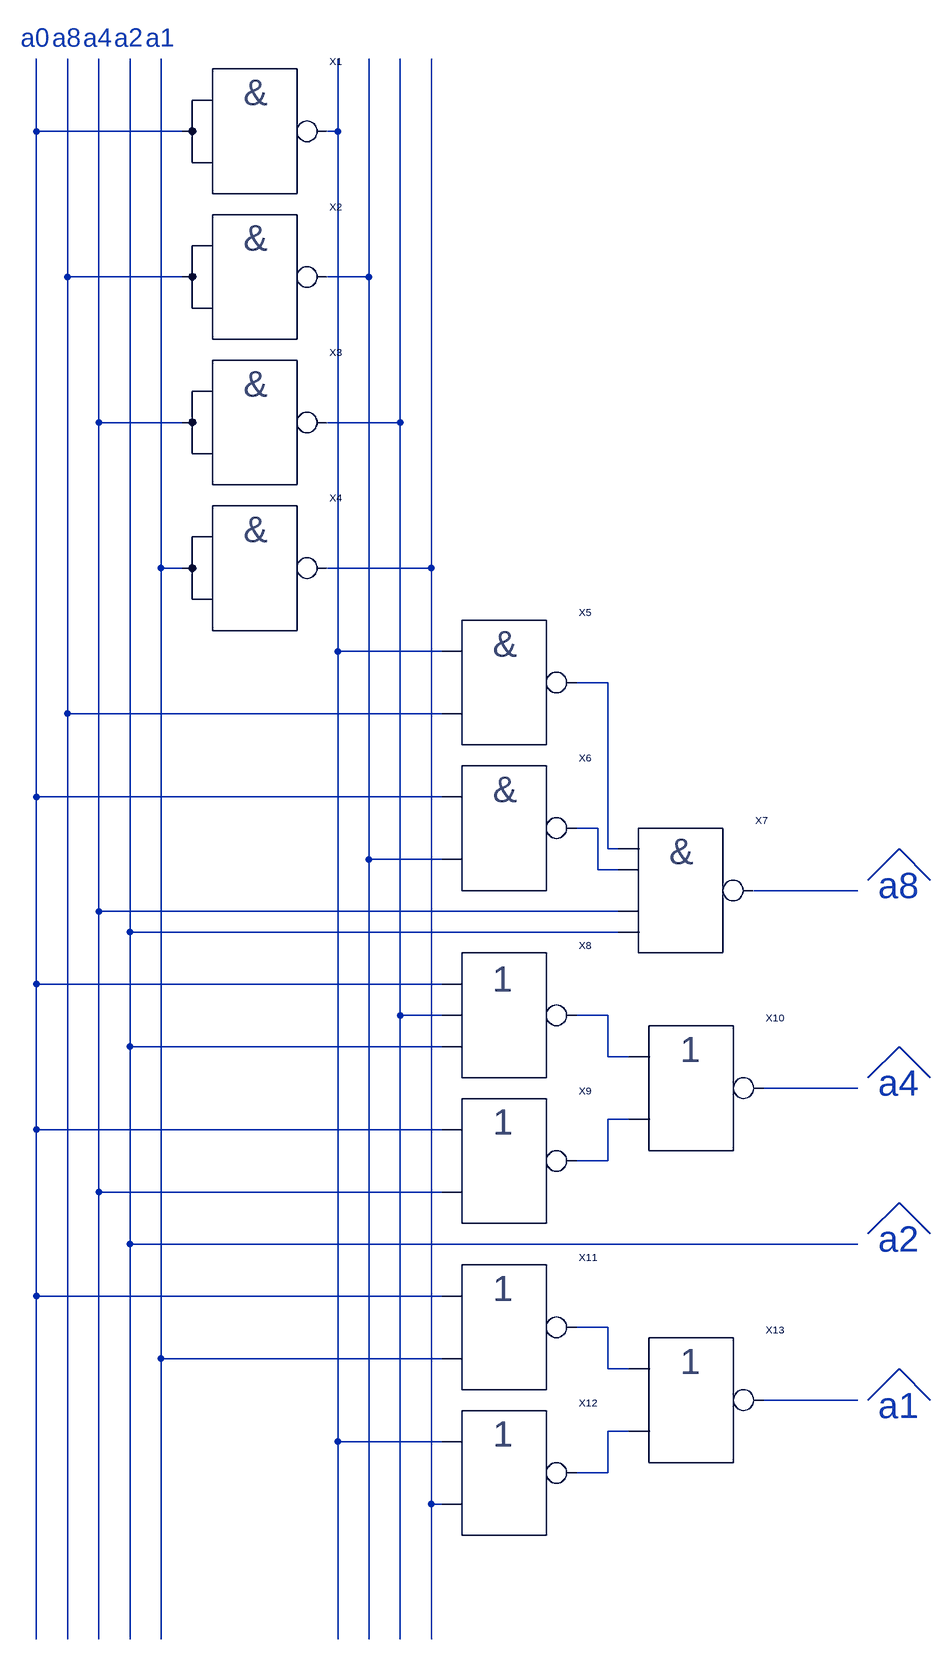
[diagram p0: schematic PR.asc]
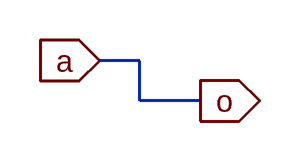
[diagram p1: sub-circuit nand1.asc]
PR.asc, the LTspice schematic file:
Version 4
SHEET 1 968 2276
WIRE -464 -48 -464 -160
WIRE -240 -48 -464 -48
WIRE 0 -48 0 -160
WIRE 0 -48 -16 -48
WIRE -416 176 -416 -160
WIRE -240 176 -416 176
WIRE 48 176 48 -160
WIRE 48 176 -16 176
WIRE -368 400 -368 -160
WIRE -240 400 -368 400
WIRE 96 400 96 -160
WIRE 96 400 -16 400
WIRE -272 624 -272 -160
WIRE -240 624 -272 624
WIRE 144 624 144 -160
WIRE 144 624 -16 624
WIRE 0 752 0 -48
WIRE 160 752 0 752
WIRE 416 800 368 800
WIRE -416 848 -416 176
WIRE 160 848 -416 848
WIRE -464 976 -464 -48
WIRE 160 976 -464 976
WIRE 400 1024 368 1024
WIRE 416 1056 416 800
WIRE 432 1056 416 1056
WIRE 48 1072 48 176
WIRE 160 1072 48 1072
WIRE 400 1088 400 1024
WIRE 432 1088 400 1088
WIRE 816 1104 864 1056
WIRE 912 1104 864 1056
WIRE 800 1120 640 1120
WIRE -368 1152 -368 400
WIRE 432 1152 -368 1152
WIRE -320 1184 -320 -160
WIRE 432 1184 -320 1184
WIRE -464 1264 -464 976
WIRE 160 1264 -464 1264
WIRE 96 1312 96 400
WIRE 160 1312 96 1312
WIRE 416 1312 368 1312
WIRE -320 1360 -320 1184
WIRE 160 1360 -320 1360
WIRE 416 1376 416 1312
WIRE 448 1376 416 1376
WIRE 816 1408 864 1360
WIRE 912 1408 864 1360
WIRE 800 1424 656 1424
WIRE 448 1472 416 1472
WIRE -464 1488 -464 1264
WIRE 160 1488 -464 1488
WIRE 416 1536 416 1472
WIRE 416 1536 368 1536
WIRE -368 1584 -368 1152
WIRE 160 1584 -368 1584
WIRE 816 1648 864 1600
WIRE 912 1648 864 1600
WIRE -320 1664 -320 1360
WIRE 800 1664 -320 1664
WIRE -464 1744 -464 1488
WIRE 160 1744 -464 1744
WIRE 416 1792 368 1792
WIRE -272 1840 -272 624
WIRE 160 1840 -272 1840
WIRE 416 1856 416 1792
WIRE 448 1856 416 1856
WIRE 800 1904 656 1904
WIRE 816 1904 864 1856
WIRE 912 1904 864 1856
WIRE 448 1952 416 1952
WIRE 0 1968 0 752
WIRE 160 1968 0 1968
WIRE 416 2016 416 1952
WIRE 416 2016 368 2016
WIRE 144 2064 144 624
WIRE 160 2064 144 2064
WIRE -464 2272 -464 1744
WIRE -416 2272 -416 848
WIRE -368 2272 -368 1584
WIRE -320 2272 -320 1664
WIRE -272 2272 -272 1840
WIRE 0 2272 0 1968
WIRE 48 2272 48 1072
WIRE 96 2272 96 1312
WIRE 144 2272 144 2064
SYMBOL NAND1 -128 -48 R0
SYMATTR InstName X1
SYMBOL NAND1 -128 176 R0
SYMATTR InstName X2
SYMBOL NAND1 -128 400 R0
SYMATTR InstName X3
SYMBOL NAND1 -128 624 R0
SYMATTR InstName X4
SYMBOL NAND2 256 800 R0
SYMATTR InstName X5
SYMBOL NAND2 256 1024 R0
SYMATTR InstName X6
SYMBOL NAND4 528 1120 R0
SYMATTR InstName X7
SYMBOL NOR2 256 1536 R0
SYMATTR InstName X9
SYMBOL NOR2 544 1424 R0
SYMATTR InstName X10
SYMBOL NOR2 256 1792 R0
SYMATTR InstName X11
SYMBOL NOR2 256 2016 R0
SYMATTR InstName X12
SYMBOL NOR2 544 1904 R0
SYMATTR InstName X13
SYMBOL NOR3 256 1312 R0
SYMATTR InstName X8
TEXT 832 1112 Left 5 ;a8
TEXT 832 1416 Left 5 ;a4
TEXT 832 1656 Left 5 ;a2
TEXT 832 1912 Left 5 ;a1
TEXT -440 -192 Left 4 ;a8
TEXT -392 -192 Left 4 ;a4
TEXT -344 -192 Left 4 ;a2
TEXT -296 -192 Left 4 ;a1
TEXT -488 -192 Left 4 ;a0

nand1.asc, the sub-circuit schematic file:
Version 4
SHEET 1 880 680
WIRE 96 80 64 80
WIRE 96 112 96 80
WIRE 144 112 96 112
FLAG 64 80 a
IOPIN 64 80 In
FLAG 144 112 o
IOPIN 144 112 Out

The netlist it stands for:
* PR.asc
XX1 N001 N002 nand1
XX2 N003 N004 nand1
XX3 N005 N006 nand1
XX4 N007 N008 nand1
XX5 N002 N003 N009 NAND2  ; pins a b o
XX6 N001 N004 N010 NAND2  ; pins a b o
XX7 N009 N013 N012 N005 N010 NAND4  ; pins a b o c c1
XX9 N001 N005 N017 NOR2  ; pins a b o
XX10 N014 N017 N016 NOR2  ; pins a b o
XX11 N001 N007 N019 NOR2  ; pins a b o
XX12 N002 N008 N022 NOR2  ; pins a b o
XX13 N019 N022 N020 NOR2  ; pins a b o
XX8 N001 N013 N014 N006 NOR3  ; pins a b o c

* block symbol definitions
.subckt nand1 a o
.ends nand1

* a8
* a4
* a2
* a1
* a8
* a4
* a2
* a1
* a0
.backanno
.end